# Altium schematic sheet fororder.SchDoc
size A
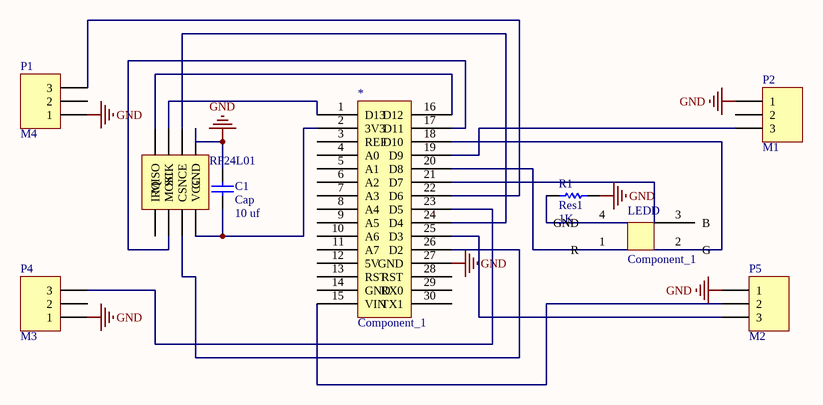
[diagram p0: fororder.SchDoc]

## Parts
*  Component_1  [PCBComponent_1]
C1  Cap  value 10 uf  [RAD-0.1]
LED  Component_1  [LED]  (part D of 4)
P1  M4  [HDR1X3]
P2  M1  [HDR1X3]
P4  M3  [HDR1X3]
P5  M2  [HDR1X3]
R1  Res1  value 1K  [AXIAL-0.3]
RF24L01  Header 4X2H  [HDR2X4H]  (value not drawn)

## Nets
GND: *.27(GND) C1.1 P1.1 P2.1 P4.1 P5.1 R1.2 RF24L01.1(GND)
Net*_1: *.1(D13) RF24L01.5(SCK)
Net*_2: *.2(3V3) C1.2 RF24L01.2(VCC)
Net*_15: *.15(VIN) P5.2
Net*_16: *.16(D12) RF24L01.7(MISO)
Net*_17: *.17(D11) RF24L01.6(MOSI)
Net*_18: *.18(D10) LED.2(G)
Net*_19: *.19(D9) P2.3
Net*_20: *.20(D8) LED.1(R)
Net*_21: *.21(D7) LED.3(B)
Net*_22: *.22(D6) P1.3
Net*_23: *.23(D5) P4.3
Net*_24: *.24(D4) RF24L01.3(CE)
Net*_25: *.25(D3) P5.3
Net*_26: *.26(D2) RF24L01.4(CSN)
NetLED_4: LED.4(GND) R1.1

Not connected (* = marked no-connect by the designer): * 3(REF) 4(A0) 5(A1) 6(A2) 7(A3) 8(A4) 9(A5) 10(A6) 11(A7) 12(5V) 13(RST) 14(GND) 28(RST) 29(RX0) 30(TX1); P1 2; P2 2; P4 2; RF24L01 8(IRQ)

## Library data of the parts
C1 = Cap: Capacitor; Published: 8-Jun-2000; LatestRevisionDate: 17-Jul-2002; LatestRevisionNote: Re-released for DXP Platform.; PackageReference: RAD-0.3; Publisher: Altium Limited; PackageDescription: Radial Cap, Thru-Hole; 2 Leads; 0.3 in Pin Spacing
P1 P2 P4 P5 = Header 3: Header, 3-Pin; LatestRevisionDate: 17-Jul-2002; LatestRevisionNote: Re-released for DXP Platform.; Publisher: Altium Limited
R1 = Res1: Resistor; Published: 8-Jun-2000; LatestRevisionDate: 17-Jul-2002; LatestRevisionNote: Re-released for DXP Platform.; PackageReference: AXIAL-0.3; Publisher: Altium Limited; PackageDescription: Axial Device, Thru-Hole; 2 Leads; 0.3 in Pin Spacing
RF24L01 = Header 4X2H: Header, 4-Pin, Dual row, Right Angle; LatestRevisionDate: 17-Jul-2002; LatestRevisionNote: Re-released for DXP Platform.; Publisher: Altium Limited